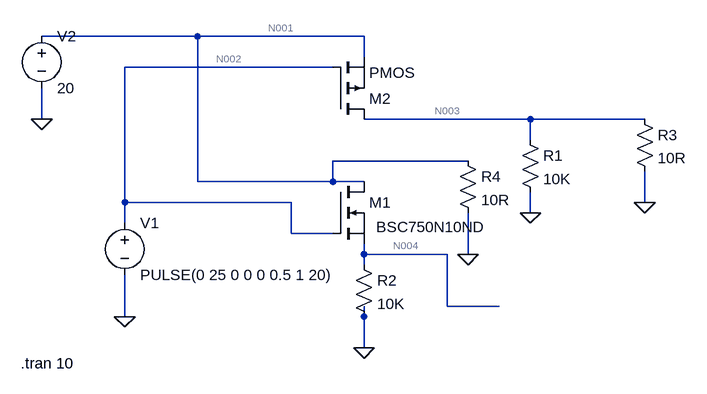
[diagram p0: schematic Draft1.asc]
Draft1.asc, the LTspice schematic file:
Version 4.1
SHEET 1 880 680
WIRE 96 -160 -144 -160
WIRE 352 -160 96 -160
WIRE 352 -128 352 -160
WIRE 304 -112 -16 -112
WIRE -144 -32 -144 -80
WIRE 608 -32 352 -32
WIRE 784 -32 608 -32
WIRE 608 0 608 -32
WIRE 512 32 304 32
WIRE 96 64 96 -160
WIRE 304 64 304 32
WIRE 304 64 96 64
WIRE 352 64 304 64
WIRE -16 96 -16 -112
WIRE 240 96 -16 96
WIRE 784 96 784 48
WIRE 608 112 608 80
WIRE -16 128 -16 96
WIRE 240 144 240 96
WIRE 304 144 240 144
WIRE 352 176 352 160
WIRE 480 176 352 176
WIRE 512 176 512 112
WIRE 352 192 352 176
WIRE 480 256 480 176
WIRE 560 256 480 256
WIRE -16 272 -16 208
WIRE 352 272 352 256
WIRE 352 320 352 272
FLAG -16 272 0
FLAG -144 -32 0
FLAG 608 112 0
FLAG 352 320 0
FLAG 784 96 0
FLAG 512 176 0
SYMBOL voltage -16 112 R0
WINDOW 123 0 0 Left 0
WINDOW 39 0 0 Left 0
SYMATTR InstName V1
SYMATTR Value PULSE(0 25 0 0 0 0.5 1 20)
SYMBOL nmos 304 64 R0
WINDOW 3 67 70 Left 2
SYMATTR InstName M1
SYMATTR Value BSC750N10ND
SYMBOL pmos 304 -32 M180
SYMATTR InstName M2
SYMBOL voltage -144 -176 R0
WINDOW 123 0 0 Left 0
WINDOW 39 0 0 Left 0
SYMATTR InstName V2
SYMATTR Value 20
SYMBOL res 592 -16 R0
SYMATTR InstName R1
SYMATTR Value 10K
SYMBOL res 336 176 R0
SYMATTR InstName R2
SYMATTR Value 10K
SYMBOL res 768 -48 R0
SYMATTR InstName R3
SYMATTR Value 10R
SYMBOL res 496 16 R0
SYMATTR InstName R4
SYMATTR Value 10R
TEXT -176 344 Left 2 !.tran 10

The netlist it stands for:
* Draft1.asc
V1 N002 0 PULSE(0 25 0 0 0 0.5 1 20)
M1 N001 N002 N004 N004 BSC750N10ND
M2 N003 N002 N001 N001 PMOS
V2 N001 0 20
R1 N003 0 10K
R2 N004 0 10K
R3 N003 0 10R
R4 N001 0 10R
.model NMOS NMOS
.model PMOS PMOS
.lib standard.mos
.tran 10
.backanno
.end

* Results of the author's LTspice run, read from the files saved beside the schematic
* Operating Point, zero values left out:
*   V(n001) = 20 V
*   V(n003) = 39.96 mV
*   V(n004) = 424 nV
*   I(R2) = 42.4 pA
*   I(R4) = 2 A
*   Id(M2) = -4 mA
*   Is(M2) = 4 mA
*   Ib(M2) = 19.97 pA
*   I(R1) = 3.996 µA
*   Id(M1) = 22.56 pA
*   Is(M1) = -22.56 pA
*   I(R3) = 3.996 mA
*   I(V2) = -2.004 A
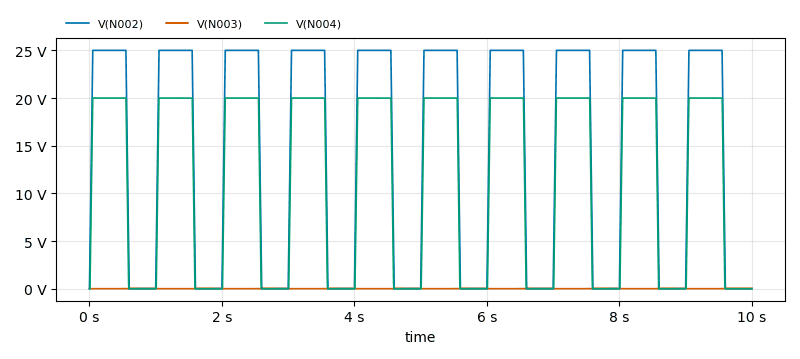
[diagram p1: Transient Analysis of Draft1.asc, plotted from the saved traces]
* Transient Analysis, 1 run:
*   V(N002): min 0 V, max 25 V, average 13.75 V, rms 18.26 V, last 0 V
*   V(N003): min 0 V, max 39.96 mV, average 17.06 mV, rms 25.79 mV, last 39.96 mV
*   V(N004): min -7.444 mV, max 20 V, average 10.89 V, rms 14.58 V, last 0 V